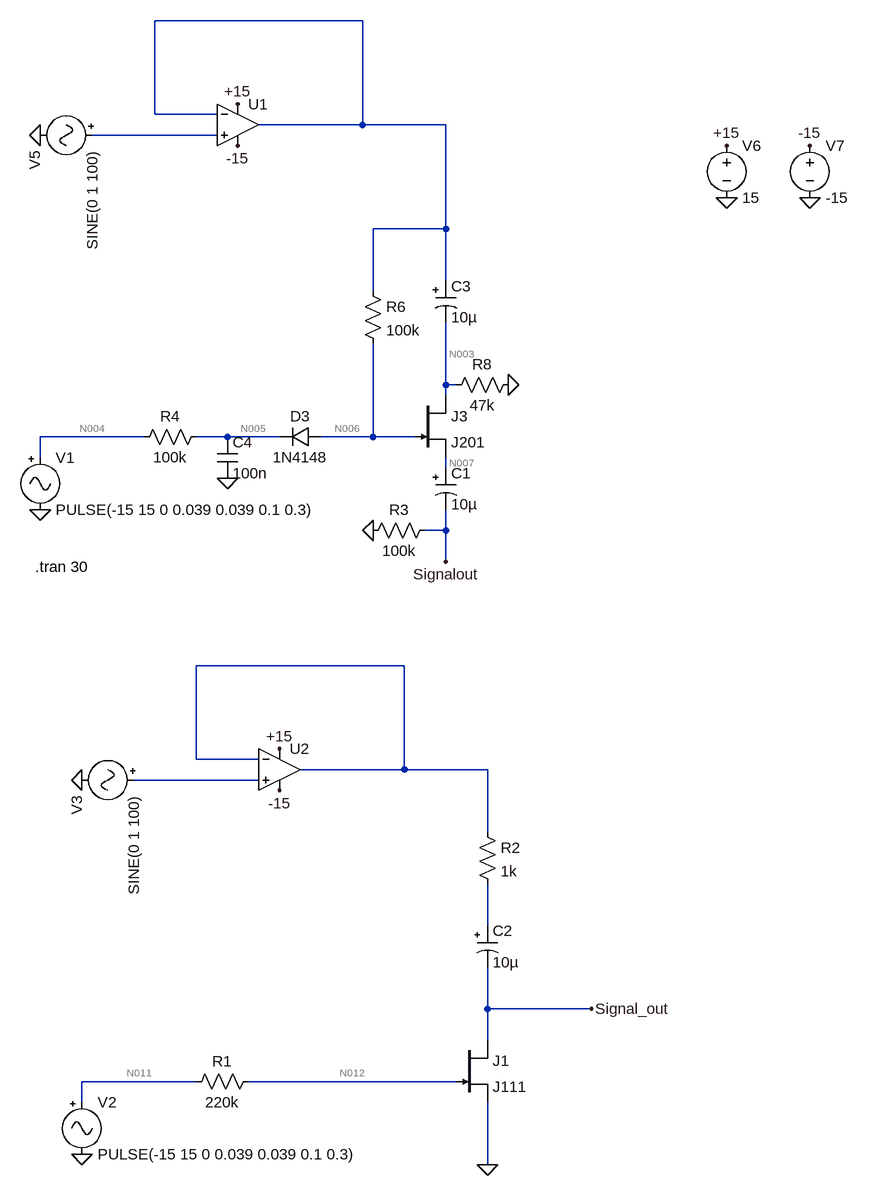
[diagram p0: schematic New X900 Mods.asc]
New X900 Mods.asc, the LTspice schematic file:
Version 4
SHEET 1 952 680
WIRE 80 -1936 -240 -1936
WIRE -240 -1792 -240 -1936
WIRE -144 -1792 -240 -1792
WIRE 80 -1776 80 -1936
WIRE 80 -1776 -80 -1776
WIRE 208 -1776 80 -1776
WIRE -144 -1760 -336 -1760
WIRE 208 -1616 208 -1776
WIRE 208 -1616 96 -1616
WIRE 208 -1536 208 -1616
WIRE 96 -1520 96 -1616
WIRE 208 -1376 208 -1472
WIRE 224 -1376 208 -1376
WIRE 208 -1360 208 -1376
WIRE -256 -1296 -416 -1296
WIRE -128 -1296 -176 -1296
WIRE -48 -1296 -128 -1296
WIRE 96 -1296 96 -1440
WIRE 96 -1296 16 -1296
WIRE 160 -1296 96 -1296
WIRE -416 -1264 -416 -1296
WIRE 208 -1248 208 -1264
WIRE 208 -1152 208 -1184
WIRE 208 -1152 176 -1152
WIRE 208 -1104 208 -1152
WIRE 144 -944 -176 -944
WIRE -176 -800 -176 -944
WIRE -80 -800 -176 -800
WIRE 144 -784 144 -944
WIRE 144 -784 -16 -784
WIRE 272 -784 144 -784
WIRE -80 -768 -272 -768
WIRE 272 -688 272 -784
WIRE 272 -544 272 -608
WIRE 272 -416 272 -480
WIRE 432 -416 272 -416
WIRE 272 -368 272 -416
WIRE -176 -304 -352 -304
WIRE 224 -304 -96 -304
WIRE -352 -272 -352 -304
WIRE 272 -176 272 -272
FLAG -416 -1760 0
FLAG 640 -1664 0
FLAG 768 -1664 0
FLAG 640 -1744 +15
FLAG 768 -1744 -15
FLAG -112 -1808 +15
FLAG -112 -1744 -15
FLAG 304 -1376 0
FLAG -416 -1184 0
FLAG -352 -768 0
FLAG -48 -816 +15
FLAG -48 -752 -15
FLAG -352 -192 0
FLAG 432 -416 Signal_out
FLAG 272 -176 0
FLAG 208 -1104 Signalout
FLAG 96 -1152 0
FLAG -128 -1232 0
SYMBOL Misc\\signal -416 -1280 R0
WINDOW 123 0 0 Left 0
WINDOW 39 0 0 Left 0
SYMATTR InstName V1
SYMATTR Value PULSE(-15 15 0 0.039 0.039 0.1 0.3)
SYMBOL njf 160 -1360 R0
SYMATTR InstName J3
SYMATTR Value J201
SYMBOL res -160 -1312 R90
WINDOW 0 0 56 VBottom 2
WINDOW 3 32 56 VTop 2
SYMATTR InstName R4
SYMATTR Value 100k
SYMBOL Misc\\signal -320 -1760 R90
WINDOW 0 24 104 Left 2
WINDOW 3 24 16 Left 2
WINDOW 123 0 0 Left 0
WINDOW 39 0 0 Left 0
SYMATTR InstName V5
SYMATTR Value SINE(0 1 100)
SYMBOL diode 16 -1312 R90
WINDOW 0 0 32 VBottom 2
WINDOW 3 32 32 VTop 2
SYMATTR InstName D3
SYMATTR Value 1N4148
SYMBOL OpAmps\\UniversalOpAmp -112 -1776 R0
SYMATTR InstName U1
SYMBOL voltage 640 -1760 R0
WINDOW 123 0 0 Left 0
WINDOW 39 0 0 Left 0
SYMATTR InstName V6
SYMATTR Value 15
SYMBOL voltage 768 -1760 R0
WINDOW 123 0 0 Left 0
WINDOW 39 0 0 Left 0
SYMATTR InstName V7
SYMATTR Value -15
SYMBOL res 80 -1536 R0
SYMATTR InstName R6
SYMATTR Value 100k
SYMBOL res 320 -1392 R90
WINDOW 0 0 56 VBottom 2
WINDOW 3 32 56 VTop 2
SYMATTR InstName R8
SYMATTR Value 47k
SYMBOL Misc\\signal -352 -288 R0
WINDOW 123 0 0 Left 0
WINDOW 39 0 0 Left 0
SYMATTR InstName V2
SYMATTR Value PULSE(-15 15 0 0.039 0.039 0.1 0.3)
SYMBOL njf 224 -368 R0
SYMATTR InstName J1
SYMATTR Value J111
SYMBOL Misc\\signal -256 -768 R90
WINDOW 0 24 104 Left 2
WINDOW 3 24 16 Left 2
WINDOW 123 0 0 Left 0
WINDOW 39 0 0 Left 0
SYMATTR InstName V3
SYMATTR Value SINE(0 1 100)
SYMBOL OpAmps\\UniversalOpAmp -48 -784 R0
SYMATTR InstName U2
SYMBOL polcap 256 -544 R0
SYMATTR InstName C2
SYMATTR Value 10µ
SYMBOL res -80 -320 R90
WINDOW 0 0 56 VBottom 2
WINDOW 3 32 56 VTop 2
SYMATTR InstName R1
SYMATTR Value 220k
SYMBOL res 256 -704 R0
SYMATTR InstName R2
SYMATTR Value 1k
SYMBOL polcap 192 -1536 R0
SYMATTR InstName C3
SYMATTR Value 10µ
SYMBOL res 192 -1168 R90
WINDOW 0 0 56 VBottom 2
WINDOW 3 32 56 VTop 2
SYMATTR InstName R3
SYMATTR Value 100k
SYMBOL cap -144 -1296 R0
SYMATTR InstName C4
SYMATTR Value 100n
SYMBOL polcap 192 -1248 R0
SYMATTR InstName C1
SYMATTR Value 10µ
TEXT -424 -1096 Left 2 !.tran 30

The netlist it stands for:
* New X900 Mods.asc
V1 N004 0 PULSE(-15 15 0 0.039 0.039 0.1 0.3)
J3 N003 N006 N007 J201
R4 N005 N004 100k
V5 N002 0 SINE(0 1 100)
D3 N006 N005 1N4148
XU1 N002 N001 +15 -15 N001 level1 Avol=1Meg GBW=10Meg Vos=0 En=0 Enk=0 In=0 Ink=0 Rin=500Meg  ; pins In+ In- V+ V- OUT
V6 +15 0 15
V7 -15 0 -15
R6 N001 N006 100k
R8 0 N003 47k
V2 N011 0 PULSE(-15 15 0 0.039 0.039 0.1 0.3)
J1 Signal_out N012 0 J111
V3 N009 0 SINE(0 1 100)
XU2 N009 N008 +15 -15 N008 level1 Avol=1Meg GBW=10Meg Vos=0 En=0 Enk=0 In=0 Ink=0 Rin=500Meg  ; pins In+ In- V+ V- OUT
C2 N010 Signal_out 10µ
R1 N012 N011 220k
R2 N008 N010 1k
C3 N001 N003 10µ
R3 Signalout 0 100k
C4 N005 0 100n
C1 N007 Signalout 10µ
.model D D
.lib standard.dio
.model NJF NJF
.model PJF PJF
.lib standard.jft
.tran 30
.lib UniversalOpAmp1.lib
.backanno
.end

* Results of the author's LTspice run, read from the files saved beside the schematic
* Operating Point, zero values left out:
*   V(n004) = -15 V
*   V(n003) = -385.4 nV
*   V(n006) = -7.267 V
*   V(n007) = -6.337 V
*   V(n005) = -7.733 V
*   V(+15) = 15 V
*   V(-15) = -15 V
*   V(n011) = -15 V
*   V(signal_out) = -10.95 V
*   V(n012) = -15 V
*   I(D3) = 72.67 µA
*   Ig(J1) = -29.44 pA
*   Is(J1) = 29.47 pA
*   Id(J3) = 8.202 pA
*   Ig(J3) = -8.201 pA
*   I(R1) = 29.44 pA
*   I(R8) = 8.201 pA
*   I(R6) = 72.67 µA
*   I(R4) = 72.67 µA
*   I(V2) = 29.44 pA
*   I(V7) = 60 nA
*   I(V6) = -60 nA
*   I(V1) = 72.67 µA
*   Ix(u1:3) = 30 nA
*   Ix(u1:4) = -30 nA
*   Ix(u1:5) = -72.67 µA
*   Ix(u2:3) = 30 nA
*   Ix(u2:4) = -30 nA